# Altium project Choin1_0.PrjPCB (part 1 of 2)
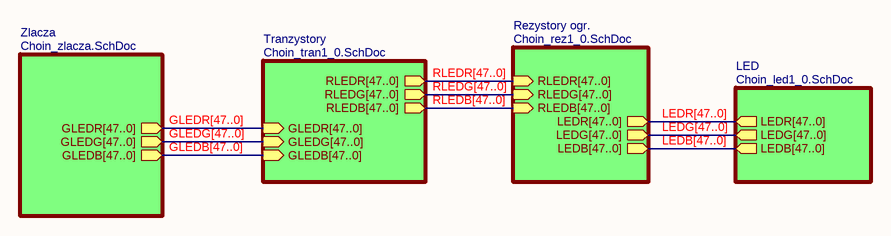
[diagram p0: Choin_main1_0.SchDoc]
Nazwa_projektu: Element oswietlenia choinkowego
5 sheets, 195 parts. Net scope: hierarchical (ports join the sheet entries above them; power ports are global).
Board file: Choin1_0.PcbDoc
Sheets:
  Choin_main1_0.SchDoc
    LED = Choin_led1_0.SchDoc
    Tranzystory = Choin_tran1_0.SchDoc
    Rezystory ogr. = Choin_rez1_0.SchDoc
    Zlacza = Choin_zlacza.SchDoc

## Sheet Choin_main1_0.SchDoc
size A4; DocumentNumber: 1; SheetNumber: 1; SheetTotal: 4; LotOfPieces: 1

### Sub-sheets
LED = Choin_led1_0.SchDoc: LEDR[47..0], LEDG[47..0], LEDB[47..0]
Rezystory ogr. = Choin_rez1_0.SchDoc: LEDR[47..0], LEDG[47..0], LEDB[47..0], RLEDR[47..0], RLEDG[47..0], RLEDB[47..0]
Tranzystory = Choin_tran1_0.SchDoc: RLEDR[47..0], RLEDG[47..0], RLEDB[47..0], GLEDR[47..0], GLEDG[47..0], GLEDB[47..0]
Zlacza = Choin_zlacza.SchDoc: GLEDR[47..0], GLEDG[47..0], GLEDB[47..0]

### Buses and harness runs
bus GLEDB[47..0] = sheet Tranzystory/GLEDB[47..0] = sheet Zlacza/GLEDB[47..0]
bus GLEDG[47..0] = sheet Tranzystory/GLEDG[47..0] = sheet Zlacza/GLEDG[47..0]
bus GLEDR[47..0] = sheet Tranzystory/GLEDR[47..0] = sheet Zlacza/GLEDR[47..0]
bus LEDB[47..0] = sheet LED/LEDB[47..0] = sheet Rezystory ogr./LEDB[47..0]
bus LEDG[47..0] = sheet LED/LEDG[47..0] = sheet Rezystory ogr./LEDG[47..0]
bus LEDR[47..0] = sheet LED/LEDR[47..0] = sheet Rezystory ogr./LEDR[47..0]
bus RLEDB[47..0] = sheet Rezystory ogr./RLEDB[47..0] = sheet Tranzystory/RLEDB[47..0]
bus RLEDG[47..0] = sheet Rezystory ogr./RLEDG[47..0] = sheet Tranzystory/RLEDG[47..0]
bus RLEDR[47..0] = sheet Rezystory ogr./RLEDR[47..0] = sheet Tranzystory/RLEDR[47..0]

### Notes on the sheet
- Projekt i wykonanie: (C) Miroslaw Lach MRQ, www.mrq-ml.com
- SVNPath:
- Page:
- Rev.
- /
- Plik:

## Sheet Choin_led1_0.SchDoc
size A4; DocumentNumber: 2; SheetNumber: 2; SheetTotal: 4; LotOfPieces: 1
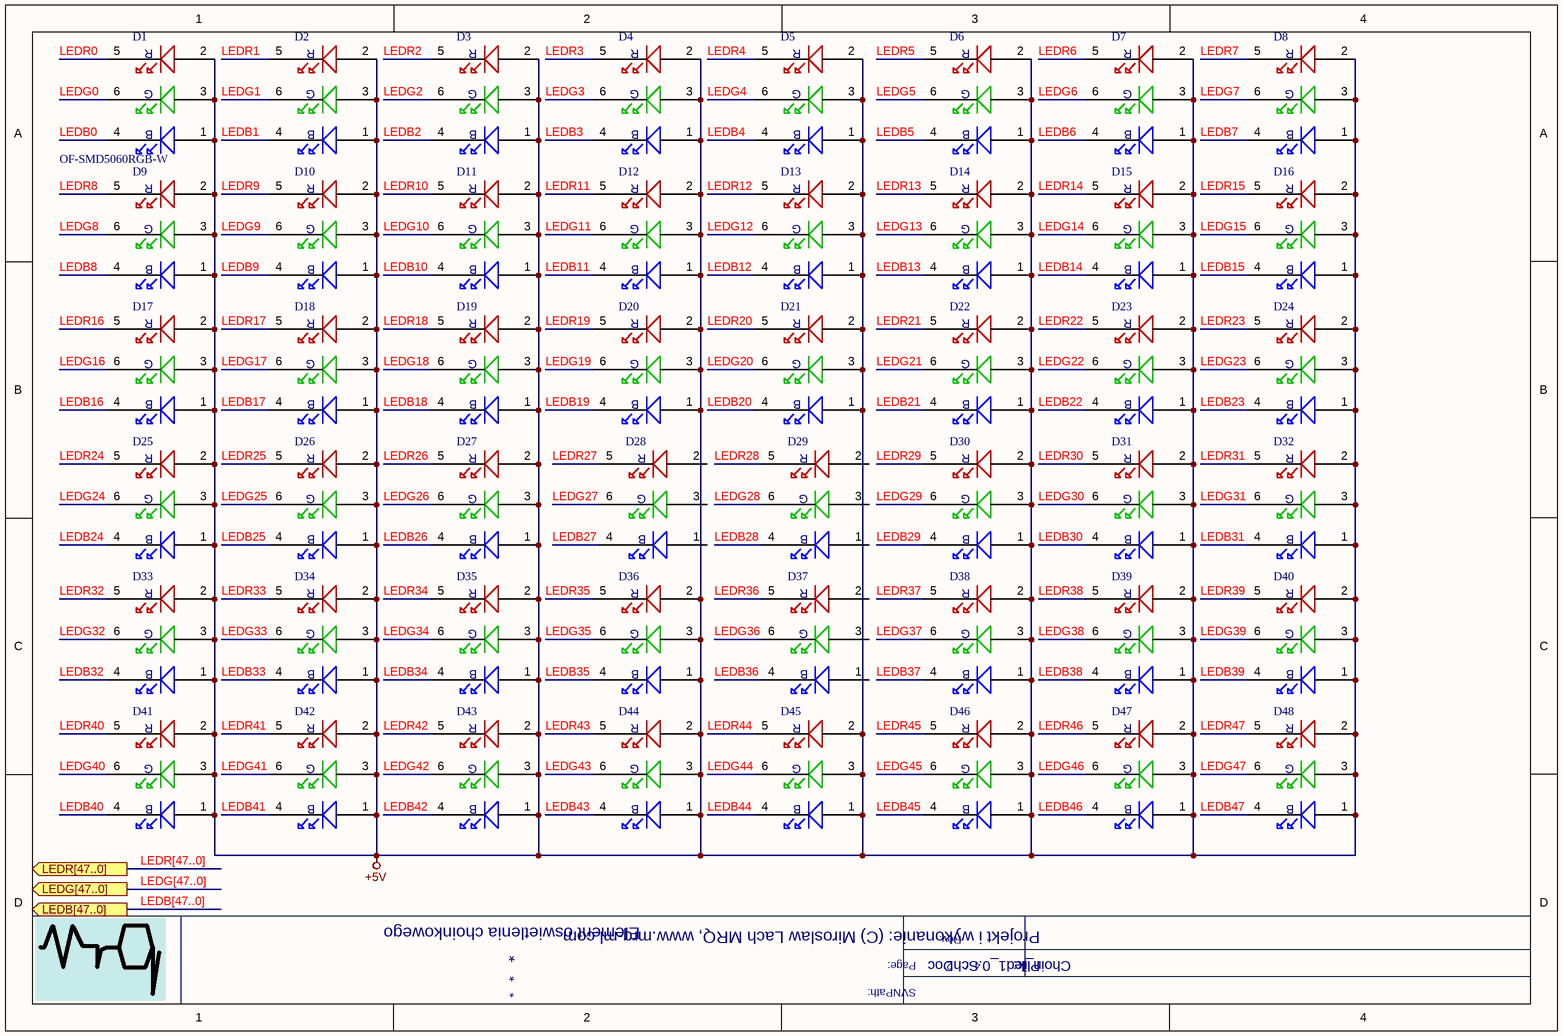
[diagram p1: Choin_led1_0.SchDoc]

### Parts
D1  OF-SMD5060RGB-W  [OF-SMD5060RGB-W]
D2  OF-SMD5060RGB-W  [OF-SMD5060RGB-W]  (value not drawn)
D3  OF-SMD5060RGB-W  [OF-SMD5060RGB-W]  (value not drawn)
D4  OF-SMD5060RGB-W  [OF-SMD5060RGB-W]  (value not drawn)
D5  OF-SMD5060RGB-W  [OF-SMD5060RGB-W]  (value not drawn)
D6  OF-SMD5060RGB-W  [OF-SMD5060RGB-W]  (value not drawn)
D7  OF-SMD5060RGB-W  [OF-SMD5060RGB-W]  (value not drawn)
D8  OF-SMD5060RGB-W  [OF-SMD5060RGB-W]  (value not drawn)
D9  OF-SMD5060RGB-W  [OF-SMD5060RGB-W]  (value not drawn)
D10  OF-SMD5060RGB-W  [OF-SMD5060RGB-W]  (value not drawn)
D11  OF-SMD5060RGB-W  [OF-SMD5060RGB-W]  (value not drawn)
D12  OF-SMD5060RGB-W  [OF-SMD5060RGB-W]  (value not drawn)
D13  OF-SMD5060RGB-W  [OF-SMD5060RGB-W]  (value not drawn)
D14  OF-SMD5060RGB-W  [OF-SMD5060RGB-W]  (value not drawn)
D15  OF-SMD5060RGB-W  [OF-SMD5060RGB-W]  (value not drawn)
D16  OF-SMD5060RGB-W  [OF-SMD5060RGB-W]  (value not drawn)
D17  OF-SMD5060RGB-W  [OF-SMD5060RGB-W]  (value not drawn)
D18  OF-SMD5060RGB-W  [OF-SMD5060RGB-W]  (value not drawn)
D19  OF-SMD5060RGB-W  [OF-SMD5060RGB-W]  (value not drawn)
D20  OF-SMD5060RGB-W  [OF-SMD5060RGB-W]  (value not drawn)
D21  OF-SMD5060RGB-W  [OF-SMD5060RGB-W]  (value not drawn)
D22  OF-SMD5060RGB-W  [OF-SMD5060RGB-W]  (value not drawn)
D23  OF-SMD5060RGB-W  [OF-SMD5060RGB-W]  (value not drawn)
D24  OF-SMD5060RGB-W  [OF-SMD5060RGB-W]  (value not drawn)
D25  OF-SMD5060RGB-W  [OF-SMD5060RGB-W]  (value not drawn)
D26  OF-SMD5060RGB-W  [OF-SMD5060RGB-W]  (value not drawn)
D27  OF-SMD5060RGB-W  [OF-SMD5060RGB-W]  (value not drawn)
D28  OF-SMD5060RGB-W  [OF-SMD5060RGB-W]  (value not drawn)
D29  OF-SMD5060RGB-W  [OF-SMD5060RGB-W]  (value not drawn)
D30  OF-SMD5060RGB-W  [OF-SMD5060RGB-W]  (value not drawn)
D31  OF-SMD5060RGB-W  [OF-SMD5060RGB-W]  (value not drawn)
D32  OF-SMD5060RGB-W  [OF-SMD5060RGB-W]  (value not drawn)
D33  OF-SMD5060RGB-W  [OF-SMD5060RGB-W]  (value not drawn)
D34  OF-SMD5060RGB-W  [OF-SMD5060RGB-W]  (value not drawn)
D35  OF-SMD5060RGB-W  [OF-SMD5060RGB-W]  (value not drawn)
D36  OF-SMD5060RGB-W  [OF-SMD5060RGB-W]  (value not drawn)
D37  OF-SMD5060RGB-W  [OF-SMD5060RGB-W]  (value not drawn)
D38  OF-SMD5060RGB-W  [OF-SMD5060RGB-W]  (value not drawn)
D39  OF-SMD5060RGB-W  [OF-SMD5060RGB-W]  (value not drawn)
D40  OF-SMD5060RGB-W  [OF-SMD5060RGB-W]  (value not drawn)
D41  OF-SMD5060RGB-W  [OF-SMD5060RGB-W]  (value not drawn)
D42  OF-SMD5060RGB-W  [OF-SMD5060RGB-W]  (value not drawn)
D43  OF-SMD5060RGB-W  [OF-SMD5060RGB-W]  (value not drawn)
D44  OF-SMD5060RGB-W  [OF-SMD5060RGB-W]  (value not drawn)
D45  OF-SMD5060RGB-W  [OF-SMD5060RGB-W]  (value not drawn)
D46  OF-SMD5060RGB-W  [OF-SMD5060RGB-W]  (value not drawn)
D47  OF-SMD5060RGB-W  [OF-SMD5060RGB-W]  (value not drawn)
D48  OF-SMD5060RGB-W  [OF-SMD5060RGB-W]  (value not drawn)

### Ports
LEDB[47..0], LEDG[47..0], LEDR[47..0]

### Nets
+5V: D1.1(ANOD) D1.2(ANOD) D1.3(ANOD) D2.1(ANOD) D2.2(ANOD) D2.3(ANOD) D3.1(ANOD) D3.2(ANOD) D3.3(ANOD) D4.1(ANOD) D4.2(ANOD) D4.3(ANOD) D5.1(ANOD) D5.2(ANOD) D5.3(ANOD) D6.1(ANOD) D6.2(ANOD) D6.3(ANOD) D7.1(ANOD) D7.2(ANOD) D7.3(ANOD) D8.1(ANOD) D8.2(ANOD) D8.3(ANOD) D9.1(ANOD) D9.2(ANOD) D9.3(ANOD) D10.1(ANOD) D10.2(ANOD) D10.3(ANOD) D11.1(ANOD) D11.2(ANOD) D11.3(ANOD) D12.1(ANOD) D12.2(ANOD) D12.3(ANOD) D13.1(ANOD) D13.2(ANOD) D13.3(ANOD) D14.1(ANOD) D14.2(ANOD) D14.3(ANOD) D15.1(ANOD) D15.2(ANOD) D15.3(ANOD) D16.1(ANOD) D16.2(ANOD) D16.3(ANOD) D17.1(ANOD) D17.2(ANOD) D17.3(ANOD) D18.1(ANOD) D18.2(ANOD) D18.3(ANOD) D19.1(ANOD) D19.2(ANOD) D19.3(ANOD) D20.1(ANOD) D20.2(ANOD) D20.3(ANOD) D21.1(ANOD) D21.2(ANOD) D21.3(ANOD) D22.1(ANOD) D22.2(ANOD) D22.3(ANOD) D23.1(ANOD) D23.2(ANOD) D23.3(ANOD) D24.1(ANOD) D24.2(ANOD) D24.3(ANOD) D25.1(ANOD) D25.2(ANOD) D25.3(ANOD) D26.1(ANOD) D26.2(ANOD) D26.3(ANOD) D27.1(ANOD) D27.2(ANOD) D27.3(ANOD) D30.1(ANOD) D30.2(ANOD) D30.3(ANOD) D31.1(ANOD) D31.2(ANOD) D31.3(ANOD) D32.1(ANOD) D32.2(ANOD) D32.3(ANOD) D33.1(ANOD) D33.2(ANOD) D33.3(ANOD) D34.1(ANOD) D34.2(ANOD) D34.3(ANOD) D35.1(ANOD) D35.2(ANOD) D35.3(ANOD) D36.1(ANOD) D36.2(ANOD) D36.3(ANOD) D38.1(ANOD) D38.2(ANOD) D38.3(ANOD) D39.1(ANOD) D39.2(ANOD) D39.3(ANOD) D40.1(ANOD) D40.2(ANOD) D40.3(ANOD) D41.1(ANOD) D41.2(ANOD) D41.3(ANOD) D42.1(ANOD) D42.2(ANOD) D42.3(ANOD) D43.1(ANOD) D43.2(ANOD) D43.3(ANOD) D44.1(ANOD) D44.2(ANOD) D44.3(ANOD) D45.1(ANOD) D45.2(ANOD) D45.3(ANOD) D46.1(ANOD) D46.2(ANOD) D46.3(ANOD) D47.1(ANOD) D47.2(ANOD) D47.3(ANOD) D48.1(ANOD) D48.2(ANOD) D48.3(ANOD)
LEDB0: D1.4(CATH)
LEDB1: D2.4(CATH)
LEDB2: D3.4(CATH)
LEDB3: D4.4(CATH)
LEDB4: D5.4(CATH)
LEDB5: D6.4(CATH)
LEDB6: D7.4(CATH)
LEDB7: D8.4(CATH)
LEDB8: D9.4(CATH)
LEDB9: D10.4(CATH)
LEDB10: D11.4(CATH)
LEDB11: D12.4(CATH)
LEDB12: D13.4(CATH)
LEDB13: D14.4(CATH)
LEDB14: D15.4(CATH)
LEDB15: D16.4(CATH)
LEDB16: D17.4(CATH)
LEDB17: D18.4(CATH)
LEDB18: D19.4(CATH)
LEDB19: D20.4(CATH)
LEDB20: D21.4(CATH)
LEDB21: D22.4(CATH)
LEDB22: D23.4(CATH)
LEDB23: D24.4(CATH)
LEDB24: D25.4(CATH)
LEDB25: D26.4(CATH)
LEDB26: D27.4(CATH)
LEDB27: D28.4(CATH)
LEDB28: D29.4(CATH)
LEDB29: D30.4(CATH)
LEDB30: D31.4(CATH)
LEDB31: D32.4(CATH)
LEDB32: D33.4(CATH)
LEDB33: D34.4(CATH)
LEDB34: D35.4(CATH)
LEDB35: D36.4(CATH)
LEDB36: D37.4(CATH)
LEDB37: D38.4(CATH)
LEDB38: D39.4(CATH)
LEDB39: D40.4(CATH)
LEDB40: D41.4(CATH)
LEDB41: D42.4(CATH)
LEDB42: D43.4(CATH)
LEDB43: D44.4(CATH)
LEDB44: D45.4(CATH)
LEDB45: D46.4(CATH)
LEDB46: D47.4(CATH)
LEDB47: D48.4(CATH)
LEDG0: D1.6(CATH)
LEDG1: D2.6(CATH)
LEDG2: D3.6(CATH)
LEDG3: D4.6(CATH)
LEDG4: D5.6(CATH)
LEDG5: D6.6(CATH)
LEDG6: D7.6(CATH)
LEDG7: D8.6(CATH)
LEDG8: D9.6(CATH)
LEDG9: D10.6(CATH)
LEDG10: D11.6(CATH)
LEDG11: D12.6(CATH)
LEDG12: D13.6(CATH)
LEDG13: D14.6(CATH)
LEDG14: D15.6(CATH)
LEDG15: D16.6(CATH)
LEDG16: D17.6(CATH)
LEDG17: D18.6(CATH)
LEDG18: D19.6(CATH)
LEDG19: D20.6(CATH)
LEDG20: D21.6(CATH)
LEDG21: D22.6(CATH)
LEDG22: D23.6(CATH)
LEDG23: D24.6(CATH)
LEDG24: D25.6(CATH)
LEDG25: D26.6(CATH)
LEDG26: D27.6(CATH)
LEDG27: D28.6(CATH)
LEDG28: D29.6(CATH)
LEDG29: D30.6(CATH)
LEDG30: D31.6(CATH)
LEDG31: D32.6(CATH)
LEDG32: D33.6(CATH)
LEDG33: D34.6(CATH)
LEDG34: D35.6(CATH)
LEDG35: D36.6(CATH)
LEDG36: D37.6(CATH)
LEDG37: D38.6(CATH)
LEDG38: D39.6(CATH)
LEDG39: D40.6(CATH)
LEDG40: D41.6(CATH)
LEDG41: D42.6(CATH)
LEDG42: D43.6(CATH)
LEDG43: D44.6(CATH)
LEDG44: D45.6(CATH)
LEDG45: D46.6(CATH)
LEDG46: D47.6(CATH)
LEDG47: D48.6(CATH)
LEDR0: D1.5(CATH)
LEDR1: D2.5(CATH)
LEDR2: D3.5(CATH)
LEDR3: D4.5(CATH)
LEDR4: D5.5(CATH)
LEDR5: D6.5(CATH)
LEDR6: D7.5(CATH)
LEDR7: D8.5(CATH)
LEDR8: D9.5(CATH)
LEDR9: D10.5(CATH)
LEDR10: D11.5(CATH)
LEDR11: D12.5(CATH)
LEDR12: D13.5(CATH)
LEDR13: D14.5(CATH)
LEDR14: D15.5(CATH)
LEDR15: D16.5(CATH)
LEDR16: D17.5(CATH)
LEDR17: D18.5(CATH)
LEDR18: D19.5(CATH)
LEDR19: D20.5(CATH)
LEDR20: D21.5(CATH)
LEDR21: D22.5(CATH)
LEDR22: D23.5(CATH)
LEDR23: D24.5(CATH)
LEDR24: D25.5(CATH)
LEDR25: D26.5(CATH)
LEDR26: D27.5(CATH)
LEDR27: D28.5(CATH)
LEDR28: D29.5(CATH)
LEDR29: D30.5(CATH)
LEDR30: D31.5(CATH)
LEDR31: D32.5(CATH)
LEDR32: D33.5(CATH)
LEDR33: D34.5(CATH)
LEDR34: D35.5(CATH)
LEDR35: D36.5(CATH)
LEDR36: D37.5(CATH)
LEDR37: D38.5(CATH)
LEDR38: D39.5(CATH)
LEDR39: D40.5(CATH)
LEDR40: D41.5(CATH)
LEDR41: D42.5(CATH)
LEDR42: D43.5(CATH)
LEDR43: D44.5(CATH)
LEDR44: D45.5(CATH)
LEDR45: D46.5(CATH)
LEDR46: D47.5(CATH)
LEDR47: D48.5(CATH)

Not connected (* = marked no-connect by the designer): D28 1(ANOD) 2(ANOD) 3(ANOD); D29 1(ANOD) 2(ANOD) 3(ANOD); D37 1(ANOD) 2(ANOD) 3(ANOD)

### Buses and harness runs
bus LEDB[47..0] = port LEDB[47..0]
bus LEDG[47..0] = port LEDG[47..0]
bus LEDR[47..0] = port LEDR[47..0]

### Notes on the sheet
- Projekt i wykonanie: (C) Miroslaw Lach MRQ, www.mrq-ml.com
- SVNPath:
- Page:
- Rev.
- /
- Plik:
- (in symbol OF-SMD5060RGB-W[[/\]]5060) R; G; B

### Library data of the parts
D1-D48 = OF-SMD5060RGB-W[[/\]]5060: Descript: 5050 Single Chip RGB Color Top LED; Currency5: PLN; Amount5: 100+; Value: OF-SMD5060RGB-W; Dimensions: 5060; ComponentLink1Description: Datasheet; ComponentLink1URL: ftp://s2.zenbox.pl:2121/opto/OF-SMD5060RGB-W.pdf; Supplier5: tme.pl; Reference5: OF-SMD5060RGB-W; Manufacturer5: Optoflash; Typ5: OF-SMD5060RGB-W; Price5: 1,3206; DateOfPrice5: 2014-01-04

## Sheet Choin_tran1_0.SchDoc
size A3; DocumentNumber: 3; SheetNumber: 3; SheetTotal: 4; LotOfPieces: 1
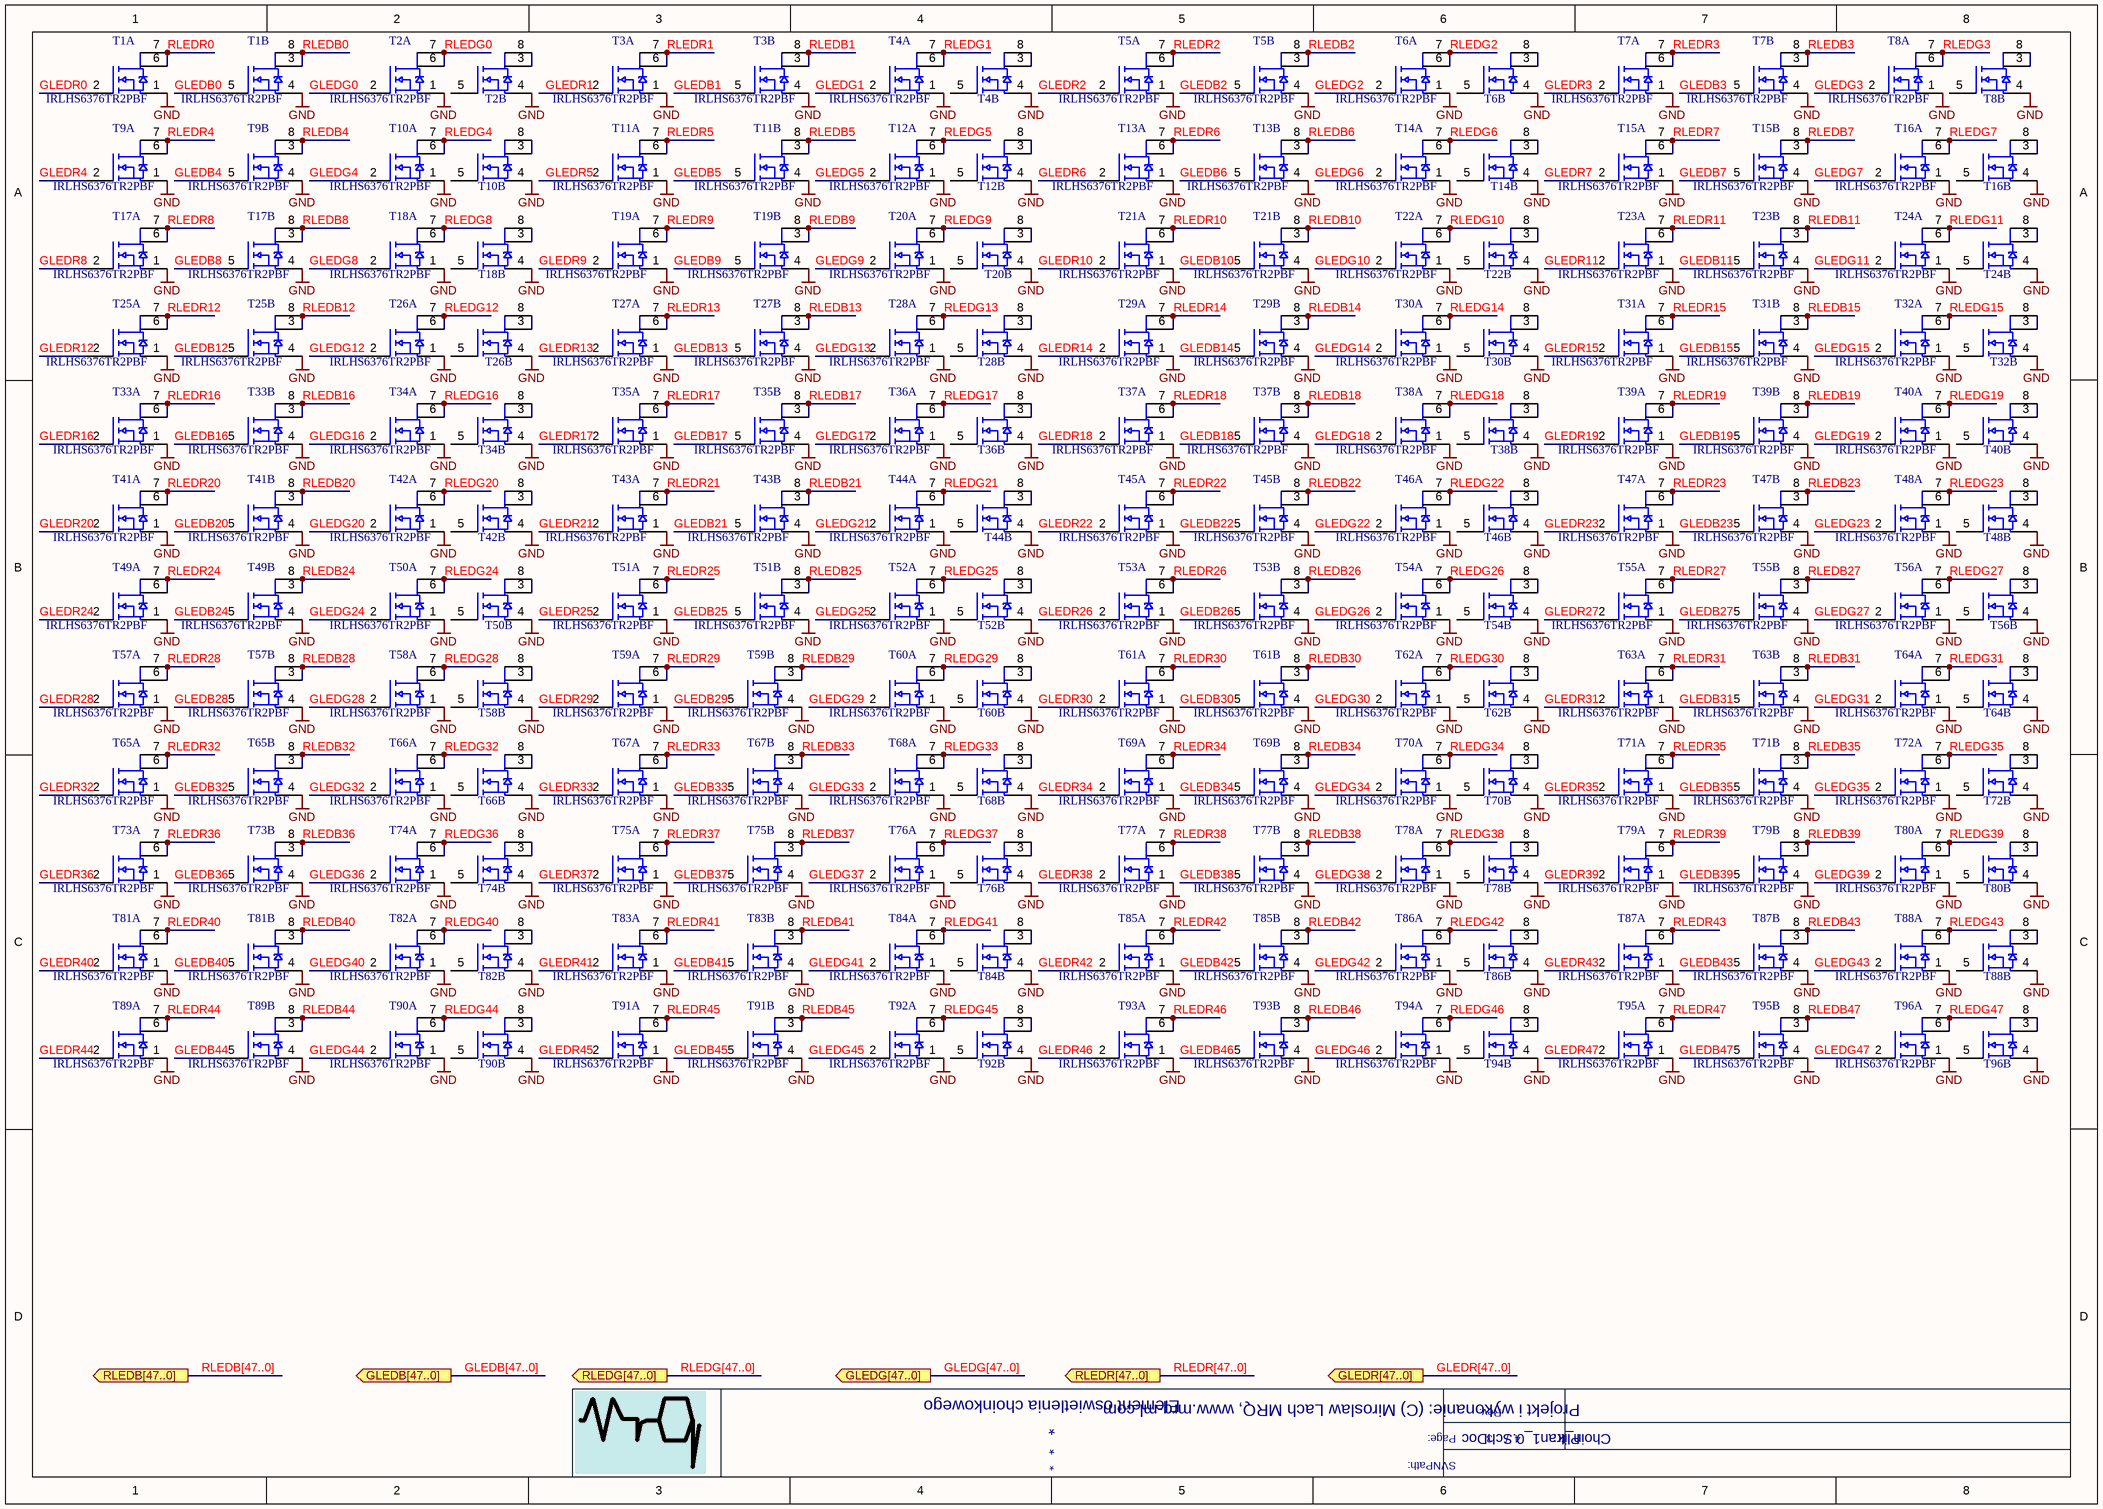
[diagram p2: Choin_tran1_0.SchDoc]

### Parts
T1  IRLHS6376TR2PBF  [PQFN2X2DUAL]  (parts A,B of 2)
T2  IRLHS6376TR2PBF  [PQFN2X2DUAL]  (parts A,B of 2)
T3  IRLHS6376TR2PBF  [PQFN2X2DUAL]  (parts A,B of 2)
T4  IRLHS6376TR2PBF  [PQFN2X2DUAL]  (parts A,B of 2)
T5  IRLHS6376TR2PBF  [PQFN2X2DUAL]  (parts A,B of 2)
T6  IRLHS6376TR2PBF  [PQFN2X2DUAL]  (parts A,B of 2)
T7  IRLHS6376TR2PBF  [PQFN2X2DUAL]  (parts A,B of 2)
T8  IRLHS6376TR2PBF  [PQFN2X2DUAL]  (parts A,B of 2)
T9  IRLHS6376TR2PBF  [PQFN2X2DUAL]  (parts A,B of 2)
T10  IRLHS6376TR2PBF  [PQFN2X2DUAL]  (parts A,B of 2)
T11  IRLHS6376TR2PBF  [PQFN2X2DUAL]  (parts A,B of 2)
T12  IRLHS6376TR2PBF  [PQFN2X2DUAL]  (parts A,B of 2)
T13  IRLHS6376TR2PBF  [PQFN2X2DUAL]  (parts A,B of 2)
T14  IRLHS6376TR2PBF  [PQFN2X2DUAL]  (parts A,B of 2)
T15  IRLHS6376TR2PBF  [PQFN2X2DUAL]  (parts A,B of 2)
T16  IRLHS6376TR2PBF  [PQFN2X2DUAL]  (parts A,B of 2)
T17  IRLHS6376TR2PBF  [PQFN2X2DUAL]  (parts A,B of 2)
T18  IRLHS6376TR2PBF  [PQFN2X2DUAL]  (parts A,B of 2)
T19  IRLHS6376TR2PBF  [PQFN2X2DUAL]  (parts A,B of 2)
T20  IRLHS6376TR2PBF  [PQFN2X2DUAL]  (parts A,B of 2)
T21  IRLHS6376TR2PBF  [PQFN2X2DUAL]  (parts A,B of 2)
T22  IRLHS6376TR2PBF  [PQFN2X2DUAL]  (parts A,B of 2)
T23  IRLHS6376TR2PBF  [PQFN2X2DUAL]  (parts A,B of 2)
T24  IRLHS6376TR2PBF  [PQFN2X2DUAL]  (parts A,B of 2)
T25  IRLHS6376TR2PBF  [PQFN2X2DUAL]  (parts A,B of 2)
T26  IRLHS6376TR2PBF  [PQFN2X2DUAL]  (parts A,B of 2)
T27  IRLHS6376TR2PBF  [PQFN2X2DUAL]  (parts A,B of 2)
T28  IRLHS6376TR2PBF  [PQFN2X2DUAL]  (parts A,B of 2)
T29  IRLHS6376TR2PBF  [PQFN2X2DUAL]  (parts A,B of 2)
T30  IRLHS6376TR2PBF  [PQFN2X2DUAL]  (parts A,B of 2)
T31  IRLHS6376TR2PBF  [PQFN2X2DUAL]  (parts A,B of 2)
T32  IRLHS6376TR2PBF  [PQFN2X2DUAL]  (parts A,B of 2)
T33  IRLHS6376TR2PBF  [PQFN2X2DUAL]  (parts A,B of 2)
T34  IRLHS6376TR2PBF  [PQFN2X2DUAL]  (parts A,B of 2)
T35  IRLHS6376TR2PBF  [PQFN2X2DUAL]  (parts A,B of 2)
T36  IRLHS6376TR2PBF  [PQFN2X2DUAL]  (parts A,B of 2)
T37  IRLHS6376TR2PBF  [PQFN2X2DUAL]  (parts A,B of 2)
T38  IRLHS6376TR2PBF  [PQFN2X2DUAL]  (parts A,B of 2)
T39  IRLHS6376TR2PBF  [PQFN2X2DUAL]  (parts A,B of 2)
T40  IRLHS6376TR2PBF  [PQFN2X2DUAL]  (parts A,B of 2)
T41  IRLHS6376TR2PBF  [PQFN2X2DUAL]  (parts A,B of 2)
T42  IRLHS6376TR2PBF  [PQFN2X2DUAL]  (parts A,B of 2)
T43  IRLHS6376TR2PBF  [PQFN2X2DUAL]  (parts A,B of 2)
T44  IRLHS6376TR2PBF  [PQFN2X2DUAL]  (parts A,B of 2)
T45  IRLHS6376TR2PBF  [PQFN2X2DUAL]  (parts A,B of 2)
T46  IRLHS6376TR2PBF  [PQFN2X2DUAL]  (parts A,B of 2)
T47  IRLHS6376TR2PBF  [PQFN2X2DUAL]  (parts A,B of 2)
T48  IRLHS6376TR2PBF  [PQFN2X2DUAL]  (parts A,B of 2)
T49  IRLHS6376TR2PBF  [PQFN2X2DUAL]  (parts A,B of 2)
T50  IRLHS6376TR2PBF  [PQFN2X2DUAL]  (parts A,B of 2)
T51  IRLHS6376TR2PBF  [PQFN2X2DUAL]  (parts A,B of 2)
T52  IRLHS6376TR2PBF  [PQFN2X2DUAL]  (parts A,B of 2)
T53  IRLHS6376TR2PBF  [PQFN2X2DUAL]  (parts A,B of 2)
T54  IRLHS6376TR2PBF  [PQFN2X2DUAL]  (parts A,B of 2)
T55  IRLHS6376TR2PBF  [PQFN2X2DUAL]  (parts A,B of 2)
T56  IRLHS6376TR2PBF  [PQFN2X2DUAL]  (parts A,B of 2)
T57  IRLHS6376TR2PBF  [PQFN2X2DUAL]  (parts A,B of 2)
T58  IRLHS6376TR2PBF  [PQFN2X2DUAL]  (parts A,B of 2)
T59  IRLHS6376TR2PBF  [PQFN2X2DUAL]  (parts A,B of 2)
T60  IRLHS6376TR2PBF  [PQFN2X2DUAL]  (parts A,B of 2)
T61  IRLHS6376TR2PBF  [PQFN2X2DUAL]  (parts A,B of 2)
T62  IRLHS6376TR2PBF  [PQFN2X2DUAL]  (parts A,B of 2)
T63  IRLHS6376TR2PBF  [PQFN2X2DUAL]  (parts A,B of 2)
T64  IRLHS6376TR2PBF  [PQFN2X2DUAL]  (parts A,B of 2)
T65  IRLHS6376TR2PBF  [PQFN2X2DUAL]  (parts A,B of 2)
T66  IRLHS6376TR2PBF  [PQFN2X2DUAL]  (parts A,B of 2)
T67  IRLHS6376TR2PBF  [PQFN2X2DUAL]  (parts A,B of 2)
T68  IRLHS6376TR2PBF  [PQFN2X2DUAL]  (parts A,B of 2)
T69  IRLHS6376TR2PBF  [PQFN2X2DUAL]  (parts A,B of 2)
T70  IRLHS6376TR2PBF  [PQFN2X2DUAL]  (parts A,B of 2)
T71  IRLHS6376TR2PBF  [PQFN2X2DUAL]  (parts A,B of 2)
T72  IRLHS6376TR2PBF  [PQFN2X2DUAL]  (parts A,B of 2)
T73  IRLHS6376TR2PBF  [PQFN2X2DUAL]  (parts A,B of 2)
T74  IRLHS6376TR2PBF  [PQFN2X2DUAL]  (parts A,B of 2)
T75  IRLHS6376TR2PBF  [PQFN2X2DUAL]  (parts A,B of 2)
T76  IRLHS6376TR2PBF  [PQFN2X2DUAL]  (parts A,B of 2)
T77  IRLHS6376TR2PBF  [PQFN2X2DUAL]  (parts A,B of 2)
T78  IRLHS6376TR2PBF  [PQFN2X2DUAL]  (parts A,B of 2)
T79  IRLHS6376TR2PBF  [PQFN2X2DUAL]  (parts A,B of 2)
T80  IRLHS6376TR2PBF  [PQFN2X2DUAL]  (parts A,B of 2)
T81  IRLHS6376TR2PBF  [PQFN2X2DUAL]  (parts A,B of 2)
T82  IRLHS6376TR2PBF  [PQFN2X2DUAL]  (parts A,B of 2)
T83  IRLHS6376TR2PBF  [PQFN2X2DUAL]  (parts A,B of 2)
T84  IRLHS6376TR2PBF  [PQFN2X2DUAL]  (parts A,B of 2)
T85  IRLHS6376TR2PBF  [PQFN2X2DUAL]  (parts A,B of 2)
T86  IRLHS6376TR2PBF  [PQFN2X2DUAL]  (parts A,B of 2)
T87  IRLHS6376TR2PBF  [PQFN2X2DUAL]  (parts A,B of 2)
T88  IRLHS6376TR2PBF  [PQFN2X2DUAL]  (parts A,B of 2)
T89  IRLHS6376TR2PBF  [PQFN2X2DUAL]  (parts A,B of 2)
T90  IRLHS6376TR2PBF  [PQFN2X2DUAL]  (parts A,B of 2)
T91  IRLHS6376TR2PBF  [PQFN2X2DUAL]  (parts A,B of 2)
T92  IRLHS6376TR2PBF  [PQFN2X2DUAL]  (parts A,B of 2)
T93  IRLHS6376TR2PBF  [PQFN2X2DUAL]  (parts A,B of 2)
T94  IRLHS6376TR2PBF  [PQFN2X2DUAL]  (parts A,B of 2)
T95  IRLHS6376TR2PBF  [PQFN2X2DUAL]  (parts A,B of 2)
T96  IRLHS6376TR2PBF  [PQFN2X2DUAL]  (parts A,B of 2)

### Ports
GLEDB[47..0], GLEDG[47..0], GLEDR[47..0], RLEDB[47..0], RLEDG[47..0], RLEDR[47..0]

### Nets
GND: T1.1(S1) T1.4(S2) T2.1(S1) T2.4(S2) T3.1(S1) T3.4(S2) T4.1(S1) T4.4(S2) T5.1(S1) T5.4(S2) T6.1(S1) T6.4(S2) T7.1(S1) T7.4(S2) T8.1(S1) T8.4(S2) T9.1(S1) T9.4(S2) T10.1(S1) T10.4(S2) T11.1(S1) T11.4(S2) T12.1(S1) T12.4(S2) T13.1(S1) T13.4(S2) T14.1(S1) T14.4(S2) T15.1(S1) T15.4(S2) T16.1(S1) T16.4(S2) T17.1(S1) T17.4(S2) T18.1(S1) T18.4(S2) T19.1(S1) T19.4(S2) T20.1(S1) T20.4(S2) T21.1(S1) T21.4(S2) T22.1(S1) T22.4(S2) T23.1(S1) T23.4(S2) T24.1(S1) T24.4(S2) T25.1(S1) T25.4(S2) T26.1(S1) T26.4(S2) T27.1(S1) T27.4(S2) T28.1(S1) T28.4(S2) T29.1(S1) T29.4(S2) T30.1(S1) T30.4(S2) T31.1(S1) T31.4(S2) T32.1(S1) T32.4(S2) T33.1(S1) T33.4(S2) T34.1(S1) T34.4(S2) T35.1(S1) T35.4(S2) T36.1(S1) T36.4(S2) T37.1(S1) T37.4(S2) T38.1(S1) T38.4(S2) T39.1(S1) T39.4(S2) T40.1(S1) T40.4(S2) T41.1(S1) T41.4(S2) T42.1(S1) T42.4(S2) T43.1(S1) T43.4(S2) T44.1(S1) T44.4(S2) T45.1(S1) T45.4(S2) T46.1(S1) T46.4(S2) T47.1(S1) T47.4(S2) T48.1(S1) T48.4(S2) T49.1(S1) T49.4(S2) T50.1(S1) T50.4(S2) T51.1(S1) T51.4(S2) T52.1(S1) T52.4(S2) T53.1(S1) T53.4(S2) T54.1(S1) T54.4(S2) T55.1(S1) T55.4(S2) T56.1(S1) T56.4(S2) T57.1(S1) T57.4(S2) T58.1(S1) T58.4(S2) T59.1(S1) T59.4(S2) T60.1(S1) T60.4(S2) T61.1(S1) T61.4(S2) T62.1(S1) T62.4(S2) T63.1(S1) T63.4(S2) T64.1(S1) T64.4(S2) T65.1(S1) T65.4(S2) T66.1(S1) T66.4(S2) T67.1(S1) T67.4(S2) T68.1(S1) T68.4(S2) T69.1(S1) T69.4(S2) T70.1(S1) T70.4(S2) T71.1(S1) T71.4(S2) T72.1(S1) T72.4(S2) T73.1(S1) T73.4(S2) T74.1(S1) T74.4(S2) T75.1(S1) T75.4(S2) T76.1(S1) T76.4(S2) T77.1(S1) T77.4(S2) T78.1(S1) T78.4(S2) T79.1(S1) T79.4(S2) T80.1(S1) T80.4(S2) T81.1(S1) T81.4(S2) T82.1(S1) T82.4(S2) T83.1(S1) T83.4(S2) T84.1(S1) T84.4(S2) T85.1(S1) T85.4(S2) T86.1(S1) T86.4(S2) T87.1(S1) T87.4(S2) T88.1(S1) T88.4(S2) T89.1(S1) T89.4(S2) T90.1(S1) T90.4(S2) T91.1(S1) T91.4(S2) T92.1(S1) T92.4(S2) T93.1(S1) T93.4(S2) T94.1(S1) T94.4(S2) T95.1(S1) T95.4(S2) T96.1(S1) T96.4(S2)
GLEDB0: T1.5(G2)
GLEDB1: T3.5(G2)
GLEDB2: T5.5(G2)
GLEDB3: T7.5(G2)
GLEDB4: T9.5(G2)
GLEDB5: T11.5(G2)
GLEDB6: T13.5(G2)
GLEDB7: T15.5(G2)
GLEDB8: T17.5(G2)
GLEDB9: T19.5(G2)
GLEDB10: T21.5(G2)
GLEDB11: T23.5(G2)
GLEDB12: T25.5(G2)
GLEDB13: T27.5(G2)
GLEDB14: T29.5(G2)
GLEDB15: T31.5(G2)
GLEDB16: T33.5(G2)
GLEDB17: T35.5(G2)
GLEDB18: T37.5(G2)
GLEDB19: T39.5(G2)
GLEDB20: T41.5(G2)
GLEDB21: T43.5(G2)
GLEDB22: T45.5(G2)
GLEDB23: T47.5(G2)
GLEDB24: T49.5(G2)
GLEDB25: T51.5(G2)
GLEDB26: T53.5(G2)
GLEDB27: T55.5(G2)
GLEDB28: T57.5(G2)
GLEDB29: T59.5(G2)
GLEDB30: T61.5(G2)
GLEDB31: T63.5(G2)
GLEDB32: T65.5(G2)
GLEDB33: T67.5(G2)
GLEDB34: T69.5(G2)
GLEDB35: T71.5(G2)
GLEDB36: T73.5(G2)
GLEDB37: T75.5(G2)
GLEDB38: T77.5(G2)
GLEDB39: T79.5(G2)
GLEDB40: T81.5(G2)
GLEDB41: T83.5(G2)
GLEDB42: T85.5(G2)
GLEDB43: T87.5(G2)
GLEDB44: T89.5(G2)
GLEDB45: T91.5(G2)
GLEDB46: T93.5(G2)
GLEDB47: T95.5(G2)
GLEDG0: T2.2(G1)
GLEDG1: T4.2(G1)
GLEDG2: T6.2(G1)
GLEDG3: T8.2(G1)
GLEDG4: T10.2(G1)
GLEDG5: T12.2(G1)
GLEDG6: T14.2(G1)
GLEDG7: T16.2(G1)
GLEDG8: T18.2(G1)
GLEDG9: T20.2(G1)
GLEDG10: T22.2(G1)
GLEDG11: T24.2(G1)
GLEDG12: T26.2(G1)
GLEDG13: T28.2(G1)
GLEDG14: T30.2(G1)
GLEDG15: T32.2(G1)
GLEDG16: T34.2(G1)
GLEDG17: T36.2(G1)
GLEDG18: T38.2(G1)
GLEDG19: T40.2(G1)
GLEDG20: T42.2(G1)
GLEDG21: T44.2(G1)
GLEDG22: T46.2(G1)
GLEDG23: T48.2(G1)
GLEDG24: T50.2(G1)
GLEDG25: T52.2(G1)
GLEDG26: T54.2(G1)
GLEDG27: T56.2(G1)
GLEDG28: T58.2(G1)
GLEDG29: T60.2(G1)
GLEDG30: T62.2(G1)
GLEDG31: T64.2(G1)
GLEDG32: T66.2(G1)
GLEDG33: T68.2(G1)
GLEDG34: T70.2(G1)
GLEDG35: T72.2(G1)
GLEDG36: T74.2(G1)
GLEDG37: T76.2(G1)
GLEDG38: T78.2(G1)
GLEDG39: T80.2(G1)
GLEDG40: T82.2(G1)
GLEDG41: T84.2(G1)
GLEDG42: T86.2(G1)
GLEDG43: T88.2(G1)
GLEDG44: T90.2(G1)
GLEDG45: T92.2(G1)
GLEDG46: T94.2(G1)
GLEDG47: T96.2(G1)
GLEDR0: T1.2(G1)
GLEDR1: T3.2(G1)
GLEDR2: T5.2(G1)
GLEDR3: T7.2(G1)
GLEDR4: T9.2(G1)
GLEDR5: T11.2(G1)
GLEDR6: T13.2(G1)
GLEDR7: T15.2(G1)
GLEDR8: T17.2(G1)
GLEDR9: T19.2(G1)
GLEDR10: T21.2(G1)
GLEDR11: T23.2(G1)
GLEDR12: T25.2(G1)
GLEDR13: T27.2(G1)
GLEDR14: T29.2(G1)
GLEDR15: T31.2(G1)
GLEDR16: T33.2(G1)
GLEDR17: T35.2(G1)
GLEDR18: T37.2(G1)
GLEDR19: T39.2(G1)
GLEDR20: T41.2(G1)
GLEDR21: T43.2(G1)
GLEDR22: T45.2(G1)
GLEDR23: T47.2(G1)
GLEDR24: T49.2(G1)
GLEDR25: T51.2(G1)
GLEDR26: T53.2(G1)
GLEDR27: T55.2(G1)
GLEDR28: T57.2(G1)
GLEDR29: T59.2(G1)
GLEDR30: T61.2(G1)
GLEDR31: T63.2(G1)
GLEDR32: T65.2(G1)
GLEDR33: T67.2(G1)
GLEDR34: T69.2(G1)
GLEDR35: T71.2(G1)
GLEDR36: T73.2(G1)
GLEDR37: T75.2(G1)
GLEDR38: T77.2(G1)
GLEDR39: T79.2(G1)
GLEDR40: T81.2(G1)
GLEDR41: T83.2(G1)
GLEDR42: T85.2(G1)
GLEDR43: T87.2(G1)
GLEDR44: T89.2(G1)
GLEDR45: T91.2(G1)
GLEDR46: T93.2(G1)
GLEDR47: T95.2(G1)
RLEDB0: T1.3(D2) T1.8(D2)
RLEDB1: T3.3(D2) T3.8(D2)
RLEDB2: T5.3(D2) T5.8(D2)
RLEDB3: T7.3(D2) T7.8(D2)
RLEDB4: T9.3(D2) T9.8(D2)
RLEDB5: T11.3(D2) T11.8(D2)
RLEDB6: T13.3(D2) T13.8(D2)
RLEDB7: T15.3(D2) T15.8(D2)
RLEDB8: T17.3(D2) T17.8(D2)
RLEDB9: T19.3(D2) T19.8(D2)
RLEDB10: T21.3(D2) T21.8(D2)
RLEDB11: T23.3(D2) T23.8(D2)
RLEDB12: T25.3(D2) T25.8(D2)
RLEDB13: T27.3(D2) T27.8(D2)
RLEDB14: T29.3(D2) T29.8(D2)
RLEDB15: T31.3(D2) T31.8(D2)
RLEDB16: T33.3(D2) T33.8(D2)
RLEDB17: T35.3(D2) T35.8(D2)
RLEDB18: T37.3(D2) T37.8(D2)
RLEDB19: T39.3(D2) T39.8(D2)
RLEDB20: T41.3(D2) T41.8(D2)
RLEDB21: T43.3(D2) T43.8(D2)
RLEDB22: T45.3(D2) T45.8(D2)
RLEDB23: T47.3(D2) T47.8(D2)
RLEDB24: T49.3(D2) T49.8(D2)
RLEDB25: T51.3(D2) T51.8(D2)
RLEDB26: T53.3(D2) T53.8(D2)
RLEDB27: T55.3(D2) T55.8(D2)
RLEDB28: T57.3(D2) T57.8(D2)
RLEDB29: T59.3(D2) T59.8(D2)
RLEDB30: T61.3(D2) T61.8(D2)
RLEDB31: T63.3(D2) T63.8(D2)
RLEDB32: T65.3(D2) T65.8(D2)
RLEDB33: T67.3(D2) T67.8(D2)
RLEDB34: T69.3(D2) T69.8(D2)
RLEDB35: T71.3(D2) T71.8(D2)
RLEDB36: T73.3(D2) T73.8(D2)
RLEDB37: T75.3(D2) T75.8(D2)
RLEDB38: T77.3(D2) T77.8(D2)
RLEDB39: T79.3(D2) T79.8(D2)
RLEDB40: T81.3(D2) T81.8(D2)
RLEDB41: T83.3(D2) T83.8(D2)
RLEDB42: T85.3(D2) T85.8(D2)
RLEDB43: T87.3(D2) T87.8(D2)
RLEDB44: T89.3(D2) T89.8(D2)
RLEDB45: T91.3(D2) T91.8(D2)
RLEDB46: T93.3(D2) T93.8(D2)
RLEDB47: T95.3(D2) T95.8(D2)
RLEDG0: T2.6(D1) T2.7(D1)
RLEDG1: T4.6(D1) T4.7(D1)
RLEDG2: T6.6(D1) T6.7(D1)
RLEDG3: T8.6(D1) T8.7(D1)
RLEDG4: T10.6(D1) T10.7(D1)
RLEDG5: T12.6(D1) T12.7(D1)
RLEDG6: T14.6(D1) T14.7(D1)
RLEDG7: T16.6(D1) T16.7(D1)
RLEDG8: T18.6(D1) T18.7(D1)
RLEDG9: T20.6(D1) T20.7(D1)
RLEDG10: T22.6(D1) T22.7(D1)
RLEDG11: T24.6(D1) T24.7(D1)
RLEDG12: T26.6(D1) T26.7(D1)
RLEDG13: T28.6(D1) T28.7(D1)
RLEDG14: T30.6(D1) T30.7(D1)
RLEDG15: T32.6(D1) T32.7(D1)
RLEDG16: T34.6(D1) T34.7(D1)
RLEDG17: T36.6(D1) T36.7(D1)
RLEDG18: T38.6(D1) T38.7(D1)
RLEDG19: T40.6(D1) T40.7(D1)
RLEDG20: T42.6(D1) T42.7(D1)
RLEDG21: T44.6(D1) T44.7(D1)
RLEDG22: T46.6(D1) T46.7(D1)
RLEDG23: T48.6(D1) T48.7(D1)
RLEDG24: T50.6(D1) T50.7(D1)
RLEDG25: T52.6(D1) T52.7(D1)
RLEDG26: T54.6(D1) T54.7(D1)
RLEDG27: T56.6(D1) T56.7(D1)
RLEDG28: T58.6(D1) T58.7(D1)
RLEDG29: T60.6(D1) T60.7(D1)
RLEDG30: T62.6(D1) T62.7(D1)
RLEDG31: T64.6(D1) T64.7(D1)
RLEDG32: T66.6(D1) T66.7(D1)
RLEDG33: T68.6(D1) T68.7(D1)
RLEDG34: T70.6(D1) T70.7(D1)
RLEDG35: T72.6(D1) T72.7(D1)
RLEDG36: T74.6(D1) T74.7(D1)
RLEDG37: T76.6(D1) T76.7(D1)
RLEDG38: T78.6(D1) T78.7(D1)
RLEDG39: T80.6(D1) T80.7(D1)
RLEDG40: T82.6(D1) T82.7(D1)
RLEDG41: T84.6(D1) T84.7(D1)
RLEDG42: T86.6(D1) T86.7(D1)
RLEDG43: T88.6(D1) T88.7(D1)
RLEDG44: T90.6(D1) T90.7(D1)
RLEDG45: T92.6(D1) T92.7(D1)
RLEDG46: T94.6(D1) T94.7(D1)
RLEDG47: T96.6(D1) T96.7(D1)
RLEDR0: T1.6(D1) T1.7(D1)
RLEDR1: T3.6(D1) T3.7(D1)
RLEDR2: T5.6(D1) T5.7(D1)
RLEDR3: T7.6(D1) T7.7(D1)
RLEDR4: T9.6(D1) T9.7(D1)
RLEDR5: T11.6(D1) T11.7(D1)
RLEDR6: T13.6(D1) T13.7(D1)
RLEDR7: T15.6(D1) T15.7(D1)
RLEDR8: T17.6(D1) T17.7(D1)
RLEDR9: T19.6(D1) T19.7(D1)
RLEDR10: T21.6(D1) T21.7(D1)
RLEDR11: T23.6(D1) T23.7(D1)
RLEDR12: T25.6(D1) T25.7(D1)
RLEDR13: T27.6(D1) T27.7(D1)
RLEDR14: T29.6(D1) T29.7(D1)
RLEDR15: T31.6(D1) T31.7(D1)
RLEDR16: T33.6(D1) T33.7(D1)
RLEDR17: T35.6(D1) T35.7(D1)
RLEDR18: T37.6(D1) T37.7(D1)
RLEDR19: T39.6(D1) T39.7(D1)
RLEDR20: T41.6(D1) T41.7(D1)
RLEDR21: T43.6(D1) T43.7(D1)
RLEDR22: T45.6(D1) T45.7(D1)
RLEDR23: T47.6(D1) T47.7(D1)
RLEDR24: T49.6(D1) T49.7(D1)
RLEDR25: T51.6(D1) T51.7(D1)
RLEDR26: T53.6(D1) T53.7(D1)
RLEDR27: T55.6(D1) T55.7(D1)
RLEDR28: T57.6(D1) T57.7(D1)
RLEDR29: T59.6(D1) T59.7(D1)
RLEDR30: T61.6(D1) T61.7(D1)
RLEDR31: T63.6(D1) T63.7(D1)
RLEDR32: T65.6(D1) T65.7(D1)
RLEDR33: T67.6(D1) T67.7(D1)
RLEDR34: T69.6(D1) T69.7(D1)
RLEDR35: T71.6(D1) T71.7(D1)
RLEDR36: T73.6(D1) T73.7(D1)
RLEDR37: T75.6(D1) T75.7(D1)
RLEDR38: T77.6(D1) T77.7(D1)
RLEDR39: T79.6(D1) T79.7(D1)
RLEDR40: T81.6(D1) T81.7(D1)
RLEDR41: T83.6(D1) T83.7(D1)
RLEDR42: T85.6(D1) T85.7(D1)
RLEDR43: T87.6(D1) T87.7(D1)
RLEDR44: T89.6(D1) T89.7(D1)
RLEDR45: T91.6(D1) T91.7(D1)
RLEDR46: T93.6(D1) T93.7(D1)
RLEDR47: T95.6(D1) T95.7(D1)
NetT2_3: T2.3(D2) T2.8(D2)
NetT4_3: T4.3(D2) T4.8(D2)
NetT6_3: T6.3(D2) T6.8(D2)
NetT8_3: T8.3(D2) T8.8(D2)
NetT10_3: T10.3(D2) T10.8(D2)
NetT12_3: T12.3(D2) T12.8(D2)
NetT14_3: T14.3(D2) T14.8(D2)
NetT16_3: T16.3(D2) T16.8(D2)
NetT18_3: T18.3(D2) T18.8(D2)
NetT20_3: T20.3(D2) T20.8(D2)
NetT22_3: T22.3(D2) T22.8(D2)
NetT24_3: T24.3(D2) T24.8(D2)
NetT26_3: T26.3(D2) T26.8(D2)
NetT28_3: T28.3(D2) T28.8(D2)
NetT30_3: T30.3(D2) T30.8(D2)
NetT32_3: T32.3(D2) T32.8(D2)
NetT34_3: T34.3(D2) T34.8(D2)
NetT36_3: T36.3(D2) T36.8(D2)
NetT38_3: T38.3(D2) T38.8(D2)
NetT40_3: T40.3(D2) T40.8(D2)
NetT42_3: T42.3(D2) T42.8(D2)
NetT44_3: T44.3(D2) T44.8(D2)
NetT46_3: T46.3(D2) T46.8(D2)
NetT48_3: T48.3(D2) T48.8(D2)
NetT50_3: T50.3(D2) T50.8(D2)
NetT52_3: T52.3(D2) T52.8(D2)
NetT54_3: T54.3(D2) T54.8(D2)
NetT56_3: T56.3(D2) T56.8(D2)
NetT58_3: T58.3(D2) T58.8(D2)
NetT60_3: T60.3(D2) T60.8(D2)
NetT62_3: T62.3(D2) T62.8(D2)
NetT64_3: T64.3(D2) T64.8(D2)
NetT66_3: T66.3(D2) T66.8(D2)
NetT68_3: T68.3(D2) T68.8(D2)
NetT70_3: T70.3(D2) T70.8(D2)
NetT72_3: T72.3(D2) T72.8(D2)
NetT74_3: T74.3(D2) T74.8(D2)
NetT76_3: T76.3(D2) T76.8(D2)
NetT78_3: T78.3(D2) T78.8(D2)
NetT80_3: T80.3(D2) T80.8(D2)
NetT82_3: T82.3(D2) T82.8(D2)
NetT84_3: T84.3(D2) T84.8(D2)
NetT86_3: T86.3(D2) T86.8(D2)
NetT88_3: T88.3(D2) T88.8(D2)
NetT90_3: T90.3(D2) T90.8(D2)
NetT92_3: T92.3(D2) T92.8(D2)
NetT94_3: T94.3(D2) T94.8(D2)
NetT96_3: T96.3(D2) T96.8(D2)

Not connected (* = marked no-connect by the designer): T2 5(G2); T4 5(G2); T6 5(G2); T8 5(G2); T10 5(G2); T12 5(G2); T14 5(G2); T16 5(G2); T18 5(G2); T20 5(G2); T22 5(G2); T24 5(G2); T26 5(G2); T28 5(G2); T30 5(G2); T32 5(G2); T34 5(G2); T36 5(G2); T38 5(G2); T40 5(G2); T42 5(G2); T44 5(G2); T46 5(G2); T48 5(G2); T50 5(G2); T52 5(G2); T54 5(G2); T56 5(G2); T58 5(G2); T60 5(G2); T62 5(G2); T64 5(G2); T66 5(G2); T68 5(G2); T70 5(G2); T72 5(G2); T74 5(G2); T76 5(G2); T78 5(G2); T80 5(G2); T82 5(G2); T84 5(G2); T86 5(G2); T88 5(G2); T90 5(G2); T92 5(G2); T94 5(G2); T96 5(G2)

### Buses and harness runs
bus GLEDB[47..0] = port GLEDB[47..0]
bus GLEDG[47..0] = port GLEDG[47..0]
bus GLEDR[47..0] = port GLEDR[47..0]
bus RLEDB[47..0] = port RLEDB[47..0]
bus RLEDG[47..0] = port RLEDG[47..0]
bus RLEDR[47..0] = port RLEDR[47..0]

### Notes on the sheet
- Projekt i wykonanie: (C) Miroslaw Lach MRQ, www.mrq-ml.com
- SVNPath:
- Page:
- Rev.
- /
- Plik:

### Library data of the parts
T1-T96 = IRLHS6376TR2PBF[[/\]]PQFN2X2DUAL: Descript: Dual N-cahnnel HEXFET Power MOSFET, 3.4A 30V; Currency5: PLN; Amount5: 5+; Value: IRLHS6376TR2PBF; Dimensions: PQFN2X2DUAL; ComponentLink1Description: Datasheet; ComponentLink1URL: ftp://s2.zenbox.pl:2121/transistors/irlhs6376pbf.pdf; Supplier5: tme.pl; Reference5: IRLHS6376TR2PBF; Manufacturer5: International Rectifier; Typ5: IRLHS6376TR2PBF; Price5: 0,75; DateOfPrice5: 2013-12-28

## Sheet Choin_rez1_0.SchDoc
size A4; DocumentNumber: 4; SheetNumber: 4; SheetTotal: 4; LotOfPieces: 1
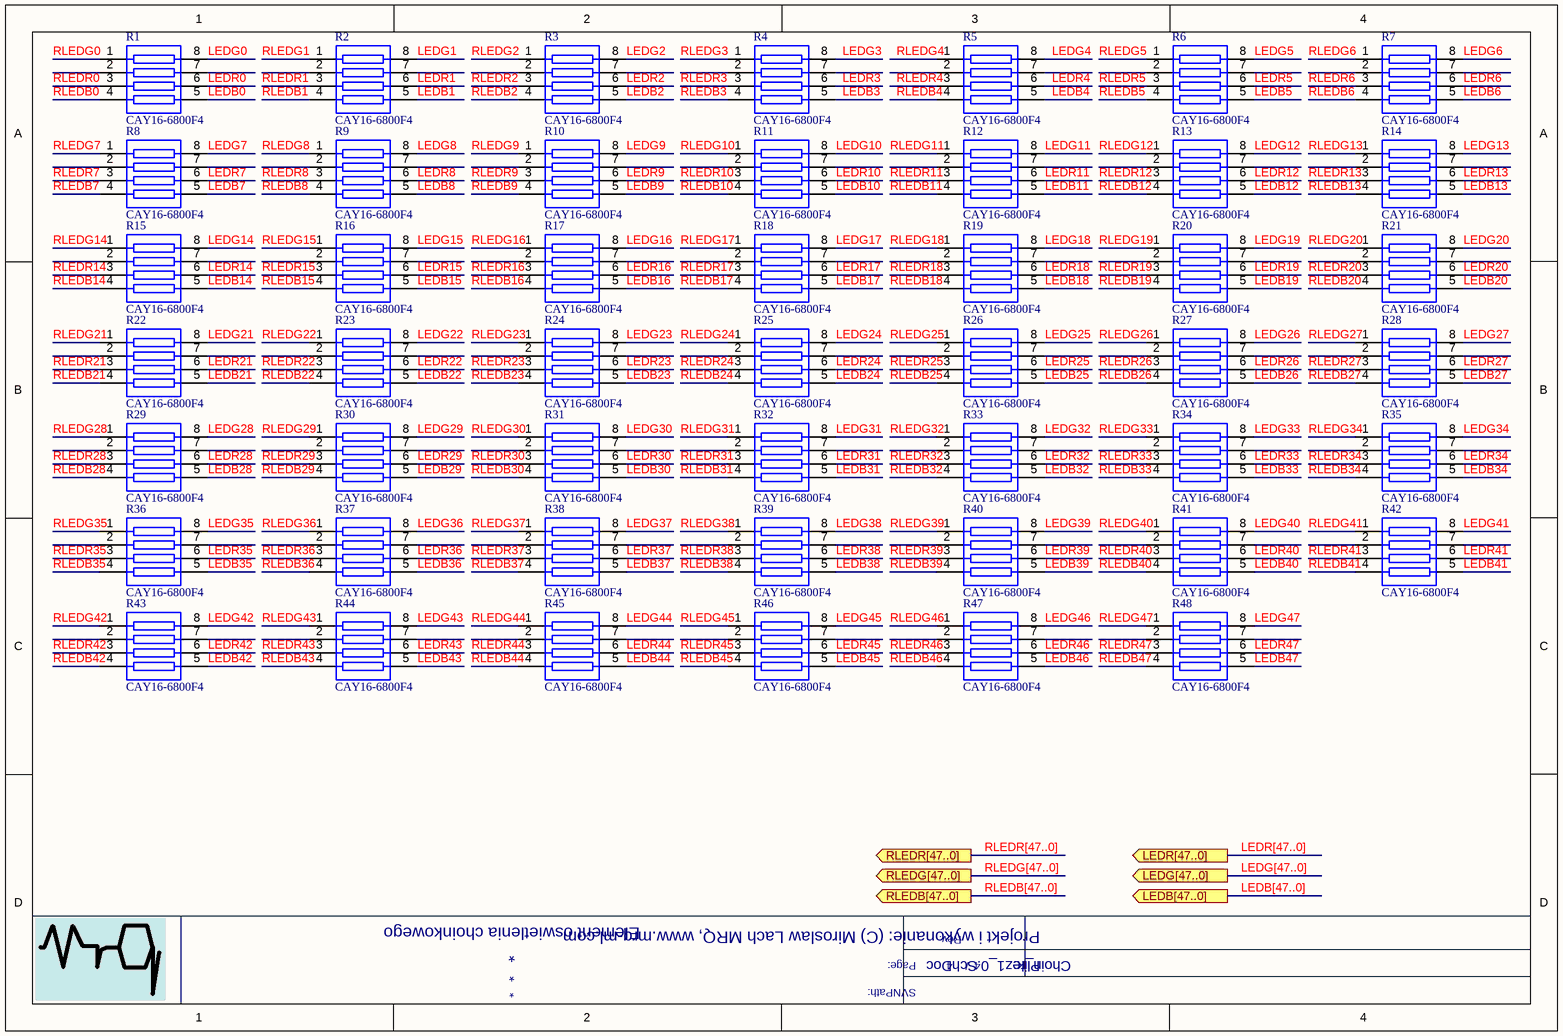
[diagram p3: Choin_rez1_0.SchDoc]

### Parts
R1  CAY16-6800F4  [1206RPS]
R2  CAY16-6800F4  [1206RPS]
R3  CAY16-6800F4  [1206RPS]
R4  CAY16-6800F4  [1206RPS]
R5  CAY16-6800F4  [1206RPS]
R6  CAY16-6800F4  [1206RPS]
R7  CAY16-6800F4  [1206RPS]
R8  CAY16-6800F4  [1206RPS]
R9  CAY16-6800F4  [1206RPS]
R10  CAY16-6800F4  [1206RPS]
R11  CAY16-6800F4  [1206RPS]
R12  CAY16-6800F4  [1206RPS]
R13  CAY16-6800F4  [1206RPS]
R14  CAY16-6800F4  [1206RPS]
R15  CAY16-6800F4  [1206RPS]
R16  CAY16-6800F4  [1206RPS]
R17  CAY16-6800F4  [1206RPS]
R18  CAY16-6800F4  [1206RPS]
R19  CAY16-6800F4  [1206RPS]
R20  CAY16-6800F4  [1206RPS]
R21  CAY16-6800F4  [1206RPS]
R22  CAY16-6800F4  [1206RPS]
R23  CAY16-6800F4  [1206RPS]
R24  CAY16-6800F4  [1206RPS]
R25  CAY16-6800F4  [1206RPS]
R26  CAY16-6800F4  [1206RPS]
R27  CAY16-6800F4  [1206RPS]
R28  CAY16-6800F4  [1206RPS]
R29  CAY16-6800F4  [1206RPS]
R30  CAY16-6800F4  [1206RPS]
R31  CAY16-6800F4  [1206RPS]
R32  CAY16-6800F4  [1206RPS]
R33  CAY16-6800F4  [1206RPS]
R34  CAY16-6800F4  [1206RPS]
R35  CAY16-6800F4  [1206RPS]
R36  CAY16-6800F4  [1206RPS]
R37  CAY16-6800F4  [1206RPS]
R38  CAY16-6800F4  [1206RPS]
R39  CAY16-6800F4  [1206RPS]
R40  CAY16-6800F4  [1206RPS]
R41  CAY16-6800F4  [1206RPS]
R42  CAY16-6800F4  [1206RPS]
R43  CAY16-6800F4  [1206RPS]
R44  CAY16-6800F4  [1206RPS]
R45  CAY16-6800F4  [1206RPS]
R46  CAY16-6800F4  [1206RPS]
R47  CAY16-6800F4  [1206RPS]
R48  CAY16-6800F4  [1206RPS]

### Ports
LEDB[47..0], LEDG[47..0], LEDR[47..0], RLEDB[47..0], RLEDG[47..0], RLEDR[47..0]

### Nets
LEDB0: R1.5(R5)
LEDB1: R2.5(R5)
LEDB2: R3.5(R5)
LEDB3: R4.5(R5)
LEDB4: R5.5(R5)
LEDB5: R6.5(R5)
LEDB6: R7.5(R5)
LEDB7: R8.5(R5)
LEDB8: R9.5(R5)
LEDB9: R10.5(R5)
LEDB10: R11.5(R5)
LEDB11: R12.5(R5)
LEDB12: R13.5(R5)
LEDB13: R14.5(R5)
LEDB14: R15.5(R5)
LEDB15: R16.5(R5)
LEDB16: R17.5(R5)
LEDB17: R18.5(R5)
LEDB18: R19.5(R5)
LEDB19: R20.5(R5)
LEDB20: R21.5(R5)
LEDB21: R22.5(R5)
LEDB22: R23.5(R5)
LEDB23: R24.5(R5)
LEDB24: R25.5(R5)
LEDB25: R26.5(R5)
LEDB26: R27.5(R5)
LEDB27: R28.5(R5)
LEDB28: R29.5(R5)
LEDB29: R30.5(R5)
LEDB30: R31.5(R5)
LEDB31: R32.5(R5)
LEDB32: R33.5(R5)
LEDB33: R34.5(R5)
LEDB34: R35.5(R5)
LEDB35: R36.5(R5)
LEDB36: R37.5(R5)
LEDB37: R38.5(R5)
LEDB38: R39.5(R5)
LEDB39: R40.5(R5)
LEDB40: R41.5(R5)
LEDB41: R42.5(R5)
LEDB42: R43.5(R5)
LEDB43: R44.5(R5)
LEDB44: R45.5(R5)
LEDB45: R46.5(R5)
LEDB46: R47.5(R5)
LEDB47: R48.5(R5)
LEDG0: R1.8(R8)
LEDG1: R2.8(R8)
LEDG2: R3.8(R8)
LEDG3: R4.8(R8)
LEDG4: R5.8(R8)
LEDG5: R6.8(R8)
LEDG6: R7.8(R8)
LEDG7: R8.8(R8)
LEDG8: R9.8(R8)
LEDG9: R10.8(R8)
LEDG10: R11.8(R8)
LEDG11: R12.8(R8)
LEDG12: R13.8(R8)
LEDG13: R14.8(R8)
LEDG14: R15.8(R8)
LEDG15: R16.8(R8)
LEDG16: R17.8(R8)
LEDG17: R18.8(R8)
LEDG18: R19.8(R8)
LEDG19: R20.8(R8)
LEDG20: R21.8(R8)
LEDG21: R22.8(R8)
LEDG22: R23.8(R8)
LEDG23: R24.8(R8)
LEDG24: R25.8(R8)
LEDG25: R26.8(R8)
LEDG26: R27.8(R8)
LEDG27: R28.8(R8)
LEDG28: R29.8(R8)
LEDG29: R30.8(R8)
LEDG30: R31.8(R8)
LEDG31: R32.8(R8)
LEDG32: R33.8(R8)
LEDG33: R34.8(R8)
LEDG34: R35.8(R8)
LEDG35: R36.8(R8)
LEDG36: R37.8(R8)
LEDG37: R38.8(R8)
LEDG38: R39.8(R8)
LEDG39: R40.8(R8)
LEDG40: R41.8(R8)
LEDG41: R42.8(R8)
LEDG42: R43.8(R8)
LEDG43: R44.8(R8)
LEDG44: R45.8(R8)
LEDG45: R46.8(R8)
LEDG46: R47.8(R8)
LEDG47: R48.8(R8)
LEDR0: R1.6(R6)
LEDR1: R2.6(R6)
LEDR2: R3.6(R6)
LEDR3: R4.6(R6)
LEDR4: R5.6(R6)
LEDR5: R6.6(R6)
LEDR6: R7.6(R6)
LEDR7: R8.6(R6)
LEDR8: R9.6(R6)
LEDR9: R10.6(R6)
LEDR10: R11.6(R6)
LEDR11: R12.6(R6)
LEDR12: R13.6(R6)
LEDR13: R14.6(R6)
LEDR14: R15.6(R6)
LEDR15: R16.6(R6)
LEDR16: R17.6(R6)
LEDR17: R18.6(R6)
LEDR18: R19.6(R6)
LEDR19: R20.6(R6)
LEDR20: R21.6(R6)
LEDR21: R22.6(R6)
LEDR22: R23.6(R6)
LEDR23: R24.6(R6)
LEDR24: R25.6(R6)
LEDR25: R26.6(R6)
LEDR26: R27.6(R6)
LEDR27: R28.6(R6)
LEDR28: R29.6(R6)
LEDR29: R30.6(R6)
LEDR30: R31.6(R6)
LEDR31: R32.6(R6)
LEDR32: R33.6(R6)
LEDR33: R34.6(R6)
LEDR34: R35.6(R6)
LEDR35: R36.6(R6)
LEDR36: R37.6(R6)
LEDR37: R38.6(R6)
LEDR38: R39.6(R6)
LEDR39: R40.6(R6)
LEDR40: R41.6(R6)
LEDR41: R42.6(R6)
LEDR42: R43.6(R6)
LEDR43: R44.6(R6)
LEDR44: R45.6(R6)
LEDR45: R46.6(R6)
LEDR46: R47.6(R6)
LEDR47: R48.6(R6)
RLEDB0: R1.4(R4)
RLEDB1: R2.4(R4)
RLEDB2: R3.4(R4)
RLEDB3: R4.4(R4)
RLEDB4: R5.4(R4)
RLEDB5: R6.4(R4)
RLEDB6: R7.4(R4)
RLEDB7: R8.4(R4)
RLEDB8: R9.4(R4)
RLEDB9: R10.4(R4)
RLEDB10: R11.4(R4)
RLEDB11: R12.4(R4)
RLEDB12: R13.4(R4)
RLEDB13: R14.4(R4)
RLEDB14: R15.4(R4)
RLEDB15: R16.4(R4)
RLEDB16: R17.4(R4)
RLEDB17: R18.4(R4)
RLEDB18: R19.4(R4)
RLEDB19: R20.4(R4)
RLEDB20: R21.4(R4)
RLEDB21: R22.4(R4)
RLEDB22: R23.4(R4)
RLEDB23: R24.4(R4)
RLEDB24: R25.4(R4)
RLEDB25: R26.4(R4)
RLEDB26: R27.4(R4)
RLEDB27: R28.4(R4)
RLEDB28: R29.4(R4)
RLEDB29: R30.4(R4)
RLEDB30: R31.4(R4)
RLEDB31: R32.4(R4)
RLEDB32: R33.4(R4)
RLEDB33: R34.4(R4)
RLEDB34: R35.4(R4)
RLEDB35: R36.4(R4)
RLEDB36: R37.4(R4)
RLEDB37: R38.4(R4)
RLEDB38: R39.4(R4)
RLEDB39: R40.4(R4)
RLEDB40: R41.4(R4)
RLEDB41: R42.4(R4)
RLEDB42: R43.4(R4)
RLEDB43: R44.4(R4)
RLEDB44: R45.4(R4)
RLEDB45: R46.4(R4)
RLEDB46: R47.4(R4)
RLEDB47: R48.4(R4)
RLEDG0: R1.1(R1)
RLEDG1: R2.1(R1)
RLEDG2: R3.1(R1)
RLEDG3: R4.1(R1)
RLEDG4: R5.1(R1)
RLEDG5: R6.1(R1)
RLEDG6: R7.1(R1)
RLEDG7: R8.1(R1)
RLEDG8: R9.1(R1)
RLEDG9: R10.1(R1)
RLEDG10: R11.1(R1)
RLEDG11: R12.1(R1)
RLEDG12: R13.1(R1)
RLEDG13: R14.1(R1)
RLEDG14: R15.1(R1)
RLEDG15: R16.1(R1)
RLEDG16: R17.1(R1)
RLEDG17: R18.1(R1)
RLEDG18: R19.1(R1)
RLEDG19: R20.1(R1)
RLEDG20: R21.1(R1)
RLEDG21: R22.1(R1)
RLEDG22: R23.1(R1)
RLEDG23: R24.1(R1)
RLEDG24: R25.1(R1)
RLEDG25: R26.1(R1)
RLEDG26: R27.1(R1)
RLEDG27: R28.1(R1)
RLEDG28: R29.1(R1)
RLEDG29: R30.1(R1)
RLEDG30: R31.1(R1)
RLEDG31: R32.1(R1)
RLEDG32: R33.1(R1)
RLEDG33: R34.1(R1)
RLEDG34: R35.1(R1)
RLEDG35: R36.1(R1)
RLEDG36: R37.1(R1)
RLEDG37: R38.1(R1)
RLEDG38: R39.1(R1)
RLEDG39: R40.1(R1)
RLEDG40: R41.1(R1)
RLEDG41: R42.1(R1)
RLEDG42: R43.1(R1)
RLEDG43: R44.1(R1)
RLEDG44: R45.1(R1)
RLEDG45: R46.1(R1)
RLEDG46: R47.1(R1)
RLEDG47: R48.1(R1)
RLEDR0: R1.3(R3)
RLEDR1: R2.3(R3)
RLEDR2: R3.3(R3)
RLEDR3: R4.3(R3)
RLEDR4: R5.3(R3)
RLEDR5: R6.3(R3)
RLEDR6: R7.3(R3)
RLEDR7: R8.3(R3)
RLEDR8: R9.3(R3)
RLEDR9: R10.3(R3)
RLEDR10: R11.3(R3)
RLEDR11: R12.3(R3)
RLEDR12: R13.3(R3)
RLEDR13: R14.3(R3)
RLEDR14: R15.3(R3)
RLEDR15: R16.3(R3)
RLEDR16: R17.3(R3)
RLEDR17: R18.3(R3)
RLEDR18: R19.3(R3)
RLEDR19: R20.3(R3)
RLEDR20: R21.3(R3)
RLEDR21: R22.3(R3)
RLEDR22: R23.3(R3)
RLEDR23: R24.3(R3)
RLEDR24: R25.3(R3)
RLEDR25: R26.3(R3)
RLEDR26: R27.3(R3)
RLEDR27: R28.3(R3)
RLEDR28: R29.3(R3)
RLEDR29: R30.3(R3)
RLEDR30: R31.3(R3)
RLEDR31: R32.3(R3)
RLEDR32: R33.3(R3)
RLEDR33: R34.3(R3)
RLEDR34: R35.3(R3)
RLEDR35: R36.3(R3)
RLEDR36: R37.3(R3)
RLEDR37: R38.3(R3)
RLEDR38: R39.3(R3)
RLEDR39: R40.3(R3)
RLEDR40: R41.3(R3)
RLEDR41: R42.3(R3)
RLEDR42: R43.3(R3)
RLEDR43: R44.3(R3)
RLEDR44: R45.3(R3)
RLEDR45: R46.3(R3)
RLEDR46: R47.3(R3)
RLEDR47: R48.3(R3)

Not connected (* = marked no-connect by the designer): R1 2(R2) 7(R7); R2 2(R2) 7(R7); R3 2(R2) 7(R7); R4 2(R2) 7(R7); R5 2(R2) 7(R7); R6 2(R2) 7(R7); R7 2(R2) 7(R7); R8 2(R2) 7(R7); R9 2(R2) 7(R7); R10 2(R2) 7(R7); R11 2(R2) 7(R7); R12 2(R2) 7(R7); R13 2(R2) 7(R7); R14 2(R2) 7(R7); R15 2(R2) 7(R7); R16 2(R2) 7(R7); R17 2(R2) 7(R7); R18 2(R2) 7(R7); R19 2(R2) 7(R7); R20 2(R2) 7(R7); R21 2(R2) 7(R7); R22 2(R2) 7(R7); R23 2(R2) 7(R7); R24 2(R2) 7(R7); R25 2(R2) 7(R7); R26 2(R2) 7(R7); R27 2(R2) 7(R7); R28 2(R2) 7(R7); R29 2(R2) 7(R7); R30 2(R2) 7(R7); R31 2(R2) 7(R7); R32 2(R2) 7(R7); R33 2(R2) 7(R7); R34 2(R2) 7(R7); R35 2(R2) 7(R7); R36 2(R2) 7(R7); R37 2(R2) 7(R7); R38 2(R2) 7(R7); R39 2(R2) 7(R7); R40 2(R2) 7(R7); R41 2(R2) 7(R7); R42 2(R2) 7(R7); R43 2(R2) 7(R7); R44 2(R2) 7(R7); R45 2(R2) 7(R7); R46 2(R2) 7(R7); R47 2(R2) 7(R7); R48 2(R2) 7(R7)

### Buses and harness runs
bus LEDB[47..0] = port LEDB[47..0]
bus LEDG[47..0] = port LEDG[47..0]
bus LEDR[47..0] = port LEDR[47..0]
bus RLEDB[47..0] = port RLEDB[47..0]
bus RLEDG[47..0] = port RLEDG[47..0]
bus RLEDR[47..0] = port RLEDR[47..0]

### Notes on the sheet
- Projekt i wykonanie: (C) Miroslaw Lach MRQ, www.mrq-ml.com
- SVNPath:
- Page:
- Rev.
- /
- Plik:

### Library data of the parts
R1-R48 = CAY16-6800F4[[/\]]1206RP[[/\]]0.063W[[/\]]1%[[/\]]4x680R 1%: DissPower: 0.063W; Tolerance: 1%; Descript: resistor network 4x680R 1%, 1206; Typ5: CAY16-6800F4LF; Currency5: PLN; Amount5: 1+; Value: CAY16-6800F4; OtherParams: 4x680R 1%; Dimensions: 1206RP; Supplier5: tme.pl; Reference5: CAY16-6800F4; Manufacturer5: Bourns; Price5: 0,0279; DateOfPrice5: 2013-12-28

## Sheet Choin_zlacza.SchDoc
size A4; LotOfPieces: 1
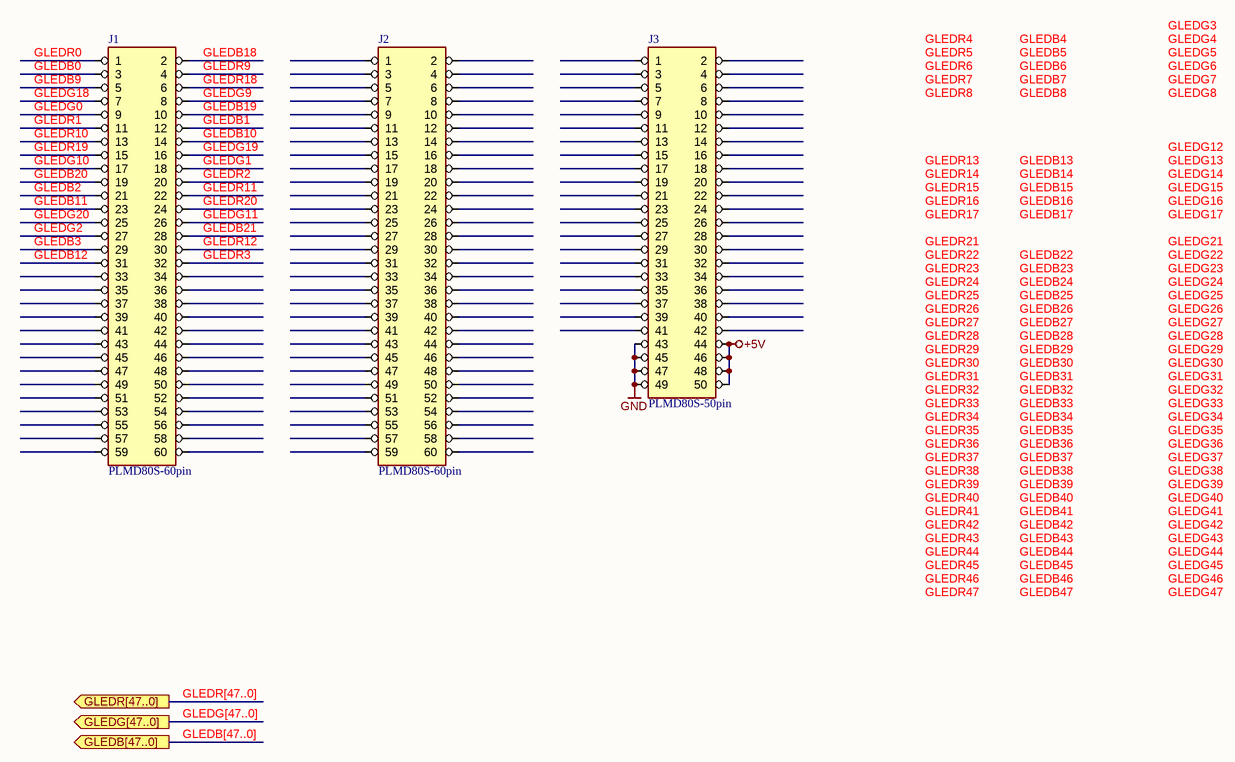
[diagram p4: Choin_zlacza.SchDoc]

### Parts
J1  PLMD80S-60pin  [PLMD60S]
J2  PLMD80S-60pin  [PLMD60S]
J3  PLMD80S-50pin  [PLMD50S]

### Ports
GLEDB[47..0], GLEDG[47..0], GLEDR[47..0]

### Nets
+5V: J3.44 J3.46 J3.48 J3.50
GND: J3.43 J3.45 J3.47 J3.49
GLEDB0: J1.3
GLEDB1: J1.12
GLEDB2: J1.21
GLEDB3: J1.29
GLEDB9: J1.5
GLEDB10: J1.14
GLEDB11: J1.23
GLEDB12: J1.31
GLEDB18: J1.2
GLEDB19: J1.10
GLEDB20: J1.19
GLEDB21: J1.28
GLEDG0: J1.9
GLEDG1: J1.18
GLEDG2: J1.27
GLEDG9: J1.8
GLEDG10: J1.17
GLEDG11: J1.26
GLEDG18: J1.7
GLEDG19: J1.16
GLEDG20: J1.25
GLEDR0: J1.1
GLEDR1: J1.11
GLEDR2: J1.20
GLEDR3: J1.32
GLEDR9: J1.4
GLEDR10: J1.13
GLEDR11: J1.22
GLEDR12: J1.30
GLEDR18: J1.6
GLEDR19: J1.15
GLEDR20: J1.24

Not connected (* = marked no-connect by the designer): J1 33 34 35 36 37 38 39 40 41 42 43 44 45 46 47 48 49 50 51 52 53 54 55 56 57 58 59 60; J2 1 2 3 4 5 6 7 8 9 10 11 12 13 14 15 16 17 18 19 20 21 22 23 24 25 26 27 28 29 30 31 32 33 34 35 36 37 38 39 40 41 42 43 44 45 46 47 48 49 50 51 52 53 54 55 56 57 58 59 60; J3 1 2 3 4 5 6 7 8 9 10 11 12 13 14 15 16 17 18 19 20 21 22 23 24 25 26 27 28 29 30 31 32 33 34 35 36 37 38 39 40 41 42

### Buses and harness runs
bus GLEDB[47..0] = port GLEDB[47..0]
bus GLEDG[47..0] = port GLEDG[47..0]
bus GLEDR[47..0] = port GLEDR[47..0]

### Notes on the sheet
- Labels drawn without touching a wire or pin: GLEDB4, GLEDB5, GLEDB6, GLEDB7, GLEDB8, GLEDB13, GLEDB14, GLEDB15, GLEDB16, GLEDB17, GLEDB22, GLEDB23, GLEDB24, GLEDB25, GLEDB26, GLEDB27, GLEDB28, GLEDB29, GLEDB30, GLEDB31, GLEDB32, GLEDB33, GLEDB34, GLEDB35, GLEDB36, GLEDB37, GLEDB38, GLEDB39, GLEDB40, GLEDB41, GLEDB42, GLEDB43, GLEDB44, GLEDB45, GLEDB46, GLEDB47, GLEDG3, GLEDG4, GLEDG5, GLEDG6, GLEDG7, GLEDG8, GLEDG12, GLEDG13, GLEDG14, GLEDG15, GLEDG16, GLEDG17, GLEDG21, GLEDG22, GLEDG23, GLEDG24, GLEDG25, GLEDG26, GLEDG27, GLEDG28, GLEDG29, GLEDG30, GLEDG31, GLEDG32, GLEDG33, GLEDG34, GLEDG35, GLEDG36, GLEDG37, GLEDG38, GLEDG39, GLEDG40, GLEDG41, GLEDG42, GLEDG43, GLEDG44, GLEDG45, GLEDG46, GLEDG47, GLEDR4, GLEDR5, GLEDR6, GLEDR7, GLEDR8, GLEDR13, GLEDR14, GLEDR15, GLEDR16, GLEDR17, GLEDR21, GLEDR22, GLEDR23, GLEDR24, GLEDR25, GLEDR26, GLEDR27, GLEDR28, GLEDR29, GLEDR30, GLEDR31, GLEDR32, GLEDR33, GLEDR34, GLEDR35, GLEDR36, GLEDR37, GLEDR38, GLEDR39, GLEDR40, GLEDR41, GLEDR42, GLEDR43, GLEDR44, GLEDR45, GLEDR46, GLEDR47
- Projekt i wykonanie: (C) Miroslaw Lach MRQ, www.mrq-ml.com
- SVNPath:
- Page:
- Rev.
- /
- Plik:

### Library data of the parts
J1 J2 = PLMD80S-60pin[[/\]]30x2x2mm: Descript: connector 2mm pitch, THT, 2x30pin, straight; Reference5: PLMD80S-LF; Currency5: PLN; Amount5: 1+; Value: PLMD80S-60pin; Dimensions: 30x2x2mm; ComponentLink1Description: Datasheet; ComponentLink1URL: http://www.mrq-ml.com/Parts/Connectors/plmd80s.pdf; Supplier5: maritex.com.pl; Price5: 1,39; DateOfPrice5: 2014-01-04
J3 = PLMD80S-50pin[[/\]]25x2x2mm: Descript: connector 2mm pitch, THT, 2x25pin, straight; Reference5: PLMD80S-LF; Currency5: PLN; Amount5: 1+; Value: PLMD80S-50pin; Dimensions: 25x2x2mm; ComponentLink1Description: Datasheet; ComponentLink1URL: http://www.mrq-ml.com/Parts/Connectors/plmd80s.pdf; Supplier5: maritex.com.pl; Price5: 1,39; DateOfPrice5: 2014-01-04